# Altium schematic sheet [2] MicroController.SchDoc
size A4; Organization: UNMEI ELECTRICAL; Address1: 16B/12 Nguyen Du Street; Address2: Da Lat City, LD Province; SheetNumber: 2; SheetTotal: 7
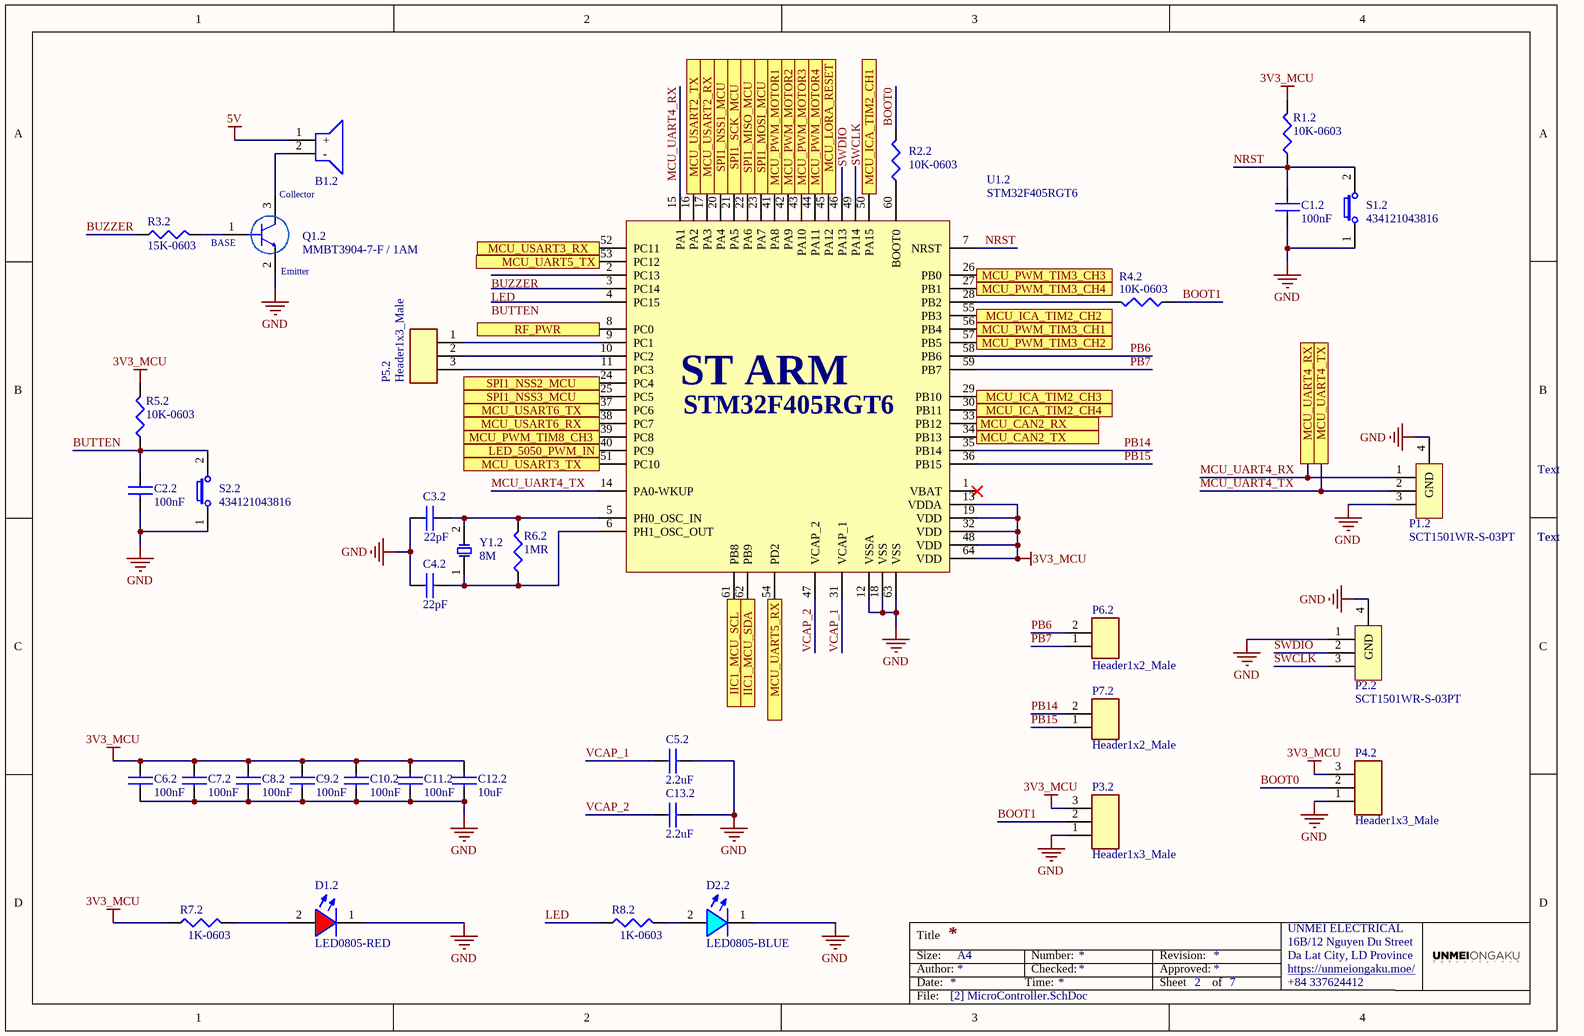
[diagram p0: [2] MicroController.SchDoc]

## Parts
B1.2  Buzzer  [Buzzer 9x5mm 60dB]  (value not drawn)
C1.2  100nF  [CAP0603]
C2.2  100nF  [CAP0603]
C3.2  22pF  [CAP0603]
C4.2  22pF  [CAP0603]
C5.2  2.2uF  [CAP0603]
C6.2  100nF  [CAP0603]
C7.2  100nF  [CAP0603]
C8.2  100nF  [CAP0603]
C9.2  100nF  [CAP0603]
C10.2  100nF  [CAP0603]
C11.2  100nF  [CAP0603]
C12.2  10uF  [CAP0603]
C13.2  2.2uF  [CAP0603]
D1.2  LED0805-RED  [LED0805-RED]
D2.2  LED0805-BLUE  [LED0805-BLUE]
P1.2  SCT1501WR-S-03PT  [Connector ZH1.5 3P SMD]
P2.2  SCT1501WR-S-03PT  [Connector ZH1.5 3P SMD]
P3.2  Header1x3_Male  [HDR1x3_2.54_MALE]
P4.2  Header1x3_Male  [HDR1x3_2.54_MALE]
P5.2  Header1x3_Male  [HDR1x3_2.54_MALE]
P6.2  Header1x2_Male  [HDR1x2_2.54_MALE]
P7.2  Header1x2_Male  [HDR1x2_2.54_MALE]
Q1.2  MMBT3904-7-F / 1AM  [SOT23]
R1.2  10K-0603  [RES0603 - 3D]
R2.2  10K-0603  [RES0603 - 3D]
R3.2  15K-0603  [RES0603 - 3D]
R4.2  10K-0603  [RES0603 - 3D]
R5.2  10K-0603  [RES0603 - 3D]
R6.2  1MR  [RES0603 - 3D]
R7.2  1K-0603  [RES0603 - 3D]
R8.2  1K-0603  [RES0603 - 3D]
S1.2  434121043816  [Switches-6x3.5x4.3mm]
S2.2  434121043816  [Switches-6x3.5x4.3mm]
U1.2  STM32F405RGT6  [LQFP64]
Y1.2  8M  [HC49-S]

## Ports
IIC1_MCU_SCL, IIC1_MCU_SDA, LED_5050_PWM_IN, MCU_CAN2_RX, MCU_CAN2_TX, MCU_ICA_TIM2_CH1, MCU_ICA_TIM2_CH2, MCU_ICA_TIM2_CH3, MCU_ICA_TIM2_CH4, MCU_LORA_RESET, MCU_PWM_MOTOR1, MCU_PWM_MOTOR2, MCU_PWM_MOTOR3, MCU_PWM_MOTOR4, MCU_PWM_TIM3_CH1, MCU_PWM_TIM3_CH2, MCU_PWM_TIM3_CH3, MCU_PWM_TIM3_CH4, MCU_PWM_TIM8_CH3, MCU_UART4_RX, MCU_UART4_TX, MCU_UART5_RX, MCU_UART5_TX, MCU_USART2_RX, MCU_USART2_TX, MCU_USART3_RX, MCU_USART3_TX, MCU_USART6_RX, MCU_USART6_TX, RF_PWR, SPI1_MISO_MCU, SPI1_MOSI_MCU, SPI1_NSS1_MCU, SPI1_NSS2_MCU, SPI1_NSS3_MCU, SPI1_SCK_MCU

## Nets
3V3_MCU: C6.2.1 C7.2.1 C8.2.1 C9.2.1 C10.2.1 C11.2.1 C12.2.1 P3.2.3 P4.2.3 R1.2.2 R5.2.2 R7.2.1 U1.2.13(VDDA) U1.2.19(VDD) U1.2.32(VDD) U1.2.48(VDD) U1.2.64(VDD)
5V: B1.2.1(+)
GND: C1.2.2 C2.2.2 C3.2.1 C4.2.1 C5.2.2 C6.2.2 C7.2.2 C8.2.2 C9.2.2 C10.2.2 C11.2.2 C12.2.2 C13.2.2 D1.2.1(+) D2.2.1(+) P1.2.3 P1.2.4(GND) P2.2.1 P2.2.4(GND) P3.2.1 P4.2.1 Q1.2.2 S1.2.1 S2.2.1 U1.2.12(VSSA) U1.2.18(VSS) U1.2.63(VSS)
BOOT0: P4.2.2 R2.2.2
BOOT1: P3.2.2 R4.2.1
BUTTEN: C2.2.1 R5.2.1 S2.2.2 U1.2.4(PC15)
BUZZER: R3.2.1 U1.2.2(PC13)
IIC1_MCU_SCL: U1.2.61(PB8) ; port IIC1_MCU_SCL
IIC1_MCU_SDA: U1.2.62(PB9) ; port IIC1_MCU_SDA
LED: R8.2.1 U1.2.3(PC14)
LED_5050_PWM_IN: U1.2.40(PC9) ; port LED_5050_PWM_IN
MCU_CAN2_RX: U1.2.33(PB12) ; port MCU_CAN2_RX
MCU_CAN2_TX: U1.2.34(PB13) ; port MCU_CAN2_TX
MCU_ICA_TIM2_CH1: U1.2.50(PA15) ; port MCU_ICA_TIM2_CH1
MCU_ICA_TIM2_CH2: U1.2.55(PB3) ; port MCU_ICA_TIM2_CH2
MCU_ICA_TIM2_CH3: U1.2.29(PB10) ; port MCU_ICA_TIM2_CH3
MCU_ICA_TIM2_CH4: U1.2.30(PB11) ; port MCU_ICA_TIM2_CH4
MCU_LORA_RESET: U1.2.45(PA12) ; port MCU_LORA_RESET
MCU_PWM_MOTOR1: U1.2.41(PA8) ; port MCU_PWM_MOTOR1
MCU_PWM_MOTOR2: U1.2.42(PA9) ; port MCU_PWM_MOTOR2
MCU_PWM_MOTOR3: U1.2.43(PA10) ; port MCU_PWM_MOTOR3
MCU_PWM_MOTOR4: U1.2.44(PA11) ; port MCU_PWM_MOTOR4
MCU_PWM_TIM3_CH1: U1.2.56(PB4) ; port MCU_PWM_TIM3_CH1
MCU_PWM_TIM3_CH2: U1.2.57(PB5) ; port MCU_PWM_TIM3_CH2
MCU_PWM_TIM3_CH3: U1.2.26(PB0) ; port MCU_PWM_TIM3_CH3
MCU_PWM_TIM3_CH4: U1.2.27(PB1) ; port MCU_PWM_TIM3_CH4
MCU_PWM_TIM8_CH3: U1.2.39(PC8) ; port MCU_PWM_TIM8_CH3
MCU_UART4_RX: P1.2.1 U1.2.15(PA1) ; port MCU_UART4_RX
MCU_UART4_TX: P1.2.2 U1.2.14(PA0-WKUP) ; port MCU_UART4_TX
MCU_UART5_RX: U1.2.54(PD2) ; port MCU_UART5_RX
MCU_UART5_TX: U1.2.53(PC12) ; port MCU_UART5_TX
MCU_USART2_RX: U1.2.17(PA3) ; port MCU_USART2_RX
MCU_USART2_TX: U1.2.16(PA2) ; port MCU_USART2_TX
MCU_USART3_RX: U1.2.52(PC11) ; port MCU_USART3_RX
MCU_USART3_TX: U1.2.51(PC10) ; port MCU_USART3_TX
MCU_USART6_RX: U1.2.38(PC7) ; port MCU_USART6_RX
MCU_USART6_TX: U1.2.37(PC6) ; port MCU_USART6_TX
NRST: C1.2.1 R1.2.1 S1.2.2 U1.2.7(NRST)
PB6: P6.2.2 U1.2.58(PB6)
PB7: P6.2.1 U1.2.59(PB7)
PB14: P7.2.2 U1.2.35(PB14)
PB15: P7.2.1 U1.2.36(PB15)
RF_PWR: U1.2.8(PC0) ; port RF_PWR
SPI1_MISO_MCU: U1.2.22(PA6) ; port SPI1_MISO_MCU
SPI1_MOSI_MCU: U1.2.23(PA7) ; port SPI1_MOSI_MCU
SPI1_NSS1_MCU: U1.2.20(PA4) ; port SPI1_NSS1_MCU
SPI1_NSS2_MCU: U1.2.24(PC4) ; port SPI1_NSS2_MCU
SPI1_NSS3_MCU: U1.2.25(PC5) ; port SPI1_NSS3_MCU
SPI1_SCK_MCU: U1.2.21(PA5) ; port SPI1_SCK_MCU
SWCLK: P2.2.3 U1.2.49(PA14)
SWDIO: P2.2.2 U1.2.46(PA13)
VCAP_1: C5.2.1 U1.2.31(VCAP_1)
VCAP_2: C13.2.1 U1.2.47(VCAP_2)
NetB1.2_2: B1.2.2(-) Q1.2.3
NetC3.2_2: C3.2.2 R6.2.2 U1.2.5(PH0_OSC_IN) Y1.2.2
NetC4.2_2: C4.2.2 R6.2.1 U1.2.6(PH1_OSC_OUT) Y1.2.1
NetD1.2_2: D1.2.2(+) R7.2.2
NetD2.2_2: D2.2.2(+) R8.2.2
NetP5.2_1: P5.2.1 U1.2.9(PC1)
NetP5.2_2: P5.2.2 U1.2.10(PC2)
NetP5.2_3: P5.2.3 U1.2.11(PC3)
NetQ1.2_1: Q1.2.1 R3.2.2
NetR2.2_1: R2.2.1 U1.2.60(BOOT0)
NetR4.2_2: R4.2.2 U1.2.28(PB2)

Not connected (* = marked no-connect by the designer): U1.2 1(VBAT)*

## Notes on the sheet
- Text
- Title
- Size:
- Date:
- Author:
- A4
- Time:
- Number:
- Checked:
- Revision:
- Sheet
- Approved:
- of
- https://unmeiongaku.moe/
- +84 337624412
- File:
- (in symbol MMBT3904-7-F / 1AM) Collector; BASE; Emitter
- (in symbol STM32F405RGT6) ST ARM

## Library data of the parts
B1.2 = Buzzer 9050 - DIP: 9050 DIP Buzzer 9x5mm 60dB; Local Supplier: thegioiic; Local Supplier Link: https://www.thegioiic.com/products/1209-dip-buzzer-12x9mm; Local Supplier Part Number: 1209 DIP Buzzer 12x9mm
C1.2 C2.2 C6.2 C7.2 C8.2 C9.2 C10.2 C11.2 = CC0603KRX7R9BB104: CAP CER 0.1UF 50V X7R 0603; Manufacturer 1: Yageo; Category 1: Capacitors; Capacitance: 0.1µF; Tolerance: ±10%; Supplier 1: Digi-Key; Supplier Part Number 1: 311-1344-1-ND; Manufacturer Part Number 1: CC0603KRX7R9BB104; RoHS 1: RoHS Compliant; Description 1: CAP CER 0.1UF 50V X7R 0603; Stock 1: 4411645; Pricing 1: 1=0.1, 10=0.031, 100=0.014, 500=0.00998, 1000=0.00783 (USD); Packaging: Cut Tape (CT); Part Status: Active; Voltage - Rated: 50V; Temperature Coefficient: X7R; Operating Temperature: -55°C ~ 125°C; Features: -; Ratings: -; Applications: General Purpose; Failure Rate: -; Mounting Type: Surface Mount, MLCC; Package / Case: 0603 (1608 Metric); Size / Dimension: 0.063" L x 0.031" W (1.60mm x 0.80mm); Height - Seated (Max): -; Thickness (Max): 0.035" (0.90mm); Lead Spacing: -; Lead Style: -; ComponentLink1URL: http://www.yageo.com/documents/recent/UPY-GPHC_X7R_6.3V-to-50V_18.pdf; ComponentLink1Description: http://www.yageo.com/documents/recent/UPY-GPHC_X7R_6.3V-to-50V_18.pdf; Value: 100nF
C3.2 C4.2 = CC0603JRNPO9BN220: Surface Mount Ceramic Multilayer Capacitor 22pF 5% C0G 50V 0603 Paper T/R; Manufacturer: Yageo; Insulation Resistance: 10GR; Temperature Coefficient: 30ppm/°C; Supplier 1: Newark; Manufacturer Part Number: CC0603JRNPO9BN220; RoHS: Yes; Category: Ceramic Capacitors; Stock 1: 70605; Pricing 1: 1=0.10000, 10=0.02100, 25=0.02000, 50=0.01900, 100=0.01800 (USD); Mount: Surface Mount; Case/Package: 0603; Number of Pins: 2; Case Code (Imperial): 0603; Case Code (Metric): 1608; Min Operating Temperature: -55°C; Max Operating Temperature: 125°C; Capacitance: 22pF; Tolerance: 5%; Voltage Rating: 50V; Packaging: Tape and Reel; Dielectric: C0G; Termination: SMD/SMT; Series: CC; Voltage Rating (DC): 50V; Package Quantity: 1; Voltage: 50V; Length: 1.6mm; Width: 0.031inch; Height: 0.8mm; Thickness: 0.035inch; Depth: 0.8mm; Radiation Hardening: No; Lead Free: Lead Free; RoHS Compliant: Yes; Reach SVHC Compliant: Yes; Supplier Part Number 1: 46WX087
C5.2 C13.2 = CC0603KRX7R6BB225: CAP CER 2.2UF 10V X7R 0603; Manufacturer 1: Yageo; Category 1: Capacitors; Capacitance: 2.2µF; Tolerance: ±10%; Supplier 1: Digi-Key; Supplier Part Number 1: 311-1797-1-ND; Manufacturer Part Number 1: CC0603KRX7R6BB225; RoHS 1: RoHS Compliant; Description 1: CAP CER 2.2UF 10V X7R 0603; Stock 1: 14291; Pricing 1: 1=0.32, 10=0.219, 100=0.1238, 500=0.0874, 1000=0.07648 (USD); Packaging: Cut Tape (CT); Part Status: Active; Voltage - Rated: 10V; Temperature Coefficient: X7R; Operating Temperature: -55°C ~ 125°C; Features: -; Ratings: -; Applications: General Purpose; Failure Rate: -; Mounting Type: Surface Mount, MLCC; Package / Case: 0603 (1608 Metric); Size / Dimension: 0.063" L x 0.031" W (1.60mm x 0.80mm); Height - Seated (Max): -; Thickness (Max): 0.035" (0.90mm); Lead Spacing: -; Lead Style: -; ComponentLink1URL: http://www.yageo.com/documents/recent/UPY-GPHC_X7R_6.3V-to-50V_18.pdf; ComponentLink1Description: http://www.yageo.com/documents/recent/UPY-GPHC_X7R_6.3V-to-50V_18.pdf; Value: 2.2uF
C12.2 = CC0603KRX5R6BB106: CAP CER 10UF 10V X5R 0603; Manufacturer 1: Yageo; Category 1: Capacitors; Capacitance: 10µF; Tolerance: ±10%; Supplier 1: Digi-Key; Supplier Part Number 1: 311-1782-1-ND; Manufacturer Part Number 1: CC0603KRX5R6BB106; RoHS 1: RoHS Compliant; Description 1: CAP CER 10UF 10V X5R 0603; Stock 1: 66566; Pricing 1: 1=0.33, 10=0.225, 100=0.1272, 500=0.08982, 1000=0.07858 (USD); Packaging: Cut Tape (CT); Part Status: Active; Voltage - Rated: 10V; Temperature Coefficient: X5R; Operating Temperature: -55°C ~ 85°C; Features: -; Ratings: -; Applications: General Purpose; Failure Rate: -; Mounting Type: Surface Mount, MLCC; Package / Case: 0603 (1608 Metric); Size / Dimension: 0.063" L x 0.031" W (1.60mm x 0.80mm); Height - Seated (Max): -; Thickness (Max): 0.035" (0.90mm); Lead Spacing: -; Lead Style: -; ComponentLink1URL: http://www.yageo.com/documents/recent/UPY-GPHC_X5R_4V-to-50V_24.pdf; ComponentLink1Description: http://www.yageo.com/documents/recent/UPY-GPHC_X5R_4V-to-50V_24.pdf; Value: 10uF
P3.2 P4.2 P5.2 = HDR1x3_2.54_MALE: Header1x3_2.54_MALE
P6.2 P7.2 = HDR1x2_2.54_MALE: Header1x2_2.54_MALE
Q1.2 = MMBT3904-7-F / 1AM: Transistor General Purpose BJT NPN 40 Volt 0.2A Automotive 3-Pin SOT-23; Manufacturer: Diodes Zetex; Collector Emitter Breakdown Voltage: 40V; Max Power Dissipation: 300mW; Max Collector Current: 200mA; Transition Frequency: 300MHz; Collector Base Voltage (VCBO): 60V; Emitter Base Voltage (VEBO): 6V; Collector Emitter Saturation Voltage: 300mV; Element Configuration: Single; hFE Min: 100; Power Dissipation: 350mW; Number of Elements: 1; Supplier 1: Digi-Key; Manufacturer Part Number: MMBT3904-7-F; RoHS: Yes; Category: BJTs; Stock 1: 468030; Pricing 1: 3000=0.02271, 6000=0.02048, 15000=0.01781, 30000=0.01603, 75000=0.01425 (USD); Mount: Surface Mount; Case/Package: SOT-23; Number of Pins: 3; Contact Plating: Tin,Matte; Weight: 0.000282oz; Min Operating Temperature: -55°C; Max Operating Temperature: 150°C; Packaging: Tape and Reel; Polarity: NPN; Package Quantity: 3000; Collector Emitter Voltage (VCEO): 40V; Gain Bandwidth Product: 300MHz; Frequency: 300MHz; Max Breakdown Voltage: 40V; Series: -; Collector-emitter Voltage-Max: 300mV; Voltage Rating (DC): 40V; Max Frequency: 300MHz; Continuous Collector Current: 200mA; Length: 3.05mm; Width: 1.4mm; Height: 1mm; Radiation Hardening: No; RoHS Compliant: Yes; Lead Free: Lead Free; REACH SVHC: No SVHC; ComponentLink1URL: https://datasheet.ciiva.com/11201/ds30036-11201778.pdf?src-supplier=Avnet; ComponentLink1Description: https://datasheet.ciiva.com/11201/ds30036-11201778.pdf?src-supplier=Avnet; ComponentLink2URL: https://datasheet.ciiva.com/15138/getdatasheetpartid-53265-15138780.pdf?src-supplier=Verical; ComponentLink2Description: https://datasheet.ciiva.com/15138/getdatasheetpartid-53265-15138780.pdf?src-supplier=Verical; ComponentLink3URL: https://datasheet.ciiva.com/22711/1915516-22711750.pdf?src-supplier=Element14; ComponentLink3Description: https://datasheet.ciiva.com/22711/1915516-22711750.pdf?src-supplier=Element14; ComponentLink4URL: https://datasheet.ciiva.com/11198/ds30036-11198999.pdf?src-supplier=Avnet; ComponentLink4Description: https://datasheet.ciiva.com/11198/ds30036-11198999.pdf?src-supplier=Avnet; ComponentLink5URL: https://datasheet.ciiva.com/6361/ds30036-6361256.pdf?src-supplier=Digi-Key; ComponentLink5Description: https://datasheet.ciiva.com/6361/ds30036-6361256.pdf?src-supplier=Digi-Key; ComponentLink6URL: https://datasheet.ciiva.com/6361/ds30036-6361254.pdf?src-supplier=Digi-Key; ComponentLink6Description: https://datasheet.ciiva.com/6361/ds30036-6361254.pdf?src-supplier=Digi-Key; Supplier Part Number 1: MMBT3904-FDITR-ND
R1.2 R2.2 R4.2 R5.2 = RC0603FR-0710KL: RES SMD 10K OHM 1% 1/10W 0603; Manufacturer: Yageo; Power (Watts): 0.1W, 1/10W; Temperature Coefficient: ±100ppm/°C; Supplier 1: Digi-Key; Manufacturer Part Number: RC0603FR-0710KL; RoHS: RoHS Compliant; Category: Resistors; Stock 1: 16545228; Pricing 1: 1=0.1, 10=0.015, 100=0.006, 1000=0.00268, 2500=0.00233 (USD); Packaging: Cut Tape (CT); Part Status: Active; Composition: Thick Film; Features: Moisture Resistant; Operating Temperature: -55°C ~ 155°C; Package / Case: 0603 (1608 Metric); Supplier Device Package: 0603; Size / Dimension: 0.063" L x 0.032" W (1.60mm x 0.80mm); Height - Seated (Max): 0.022" (0.55mm); Failure Rate: -; ComponentLink1URL: http://www.yageo.com/documents/recent/PYu-RC_Group_51_RoHS_L_7.pdf; ComponentLink1Description: http://www.yageo.com/documents/recent/PYu-RC_Group_51_RoHS_L_7.pdf; Supplier Part Number 1: 311-10.0KHRCT-ND; Value: 10K; Tolerance: ±1%
R3.2 = RC0603JR-0715KL: Thick Film Resistors - SMD 15K OHM 5%; Manufacturer: Yageo; Power Rating: 100 mW, 200 mW; Resistance: 15 kOhms; Temperature Coefficient: 100 PPM / C; Voltage Rating: 75 V; Supplier 1: Mouser; Manufacturer Part Number: RC0603JR-0715KL; RoHS: RoHS Compliant; Category: Thick Film Resistors - SMD; Stock 1: 39889; Pricing 1: 1=0.100, 10=0.015, 100=0.005, 1000=0.004, 5000=0.004 (USD); Application: High Reliability; Features: -; Height: 0.45 mm; Length: 1.6 mm; Package / Case: 0603 (1608 metric); Packaging: Cut Tape; Product: Thick Film Resistors SMD; Series: RC; Technology: Thick Film; Termination Style: SMD/SMT; Tolerance: 5 %; Type: General Purpose; Width: 0.8 mm; Brand: Yageo; Mounting Style: PCB Mount; Case Code - in: 0603; Case Code - mm: 1608; Maximum Operating Temperature: + 155 C; Minimum Operating Temperature: - 55 C; Product Type: Thick Film Resistors; Standard Pack Qty: 5000; Subcategory: Resistors; RoHS - Mouser: Y; Minimum Order Quantity: 1; Reeling: True; ComponentLink1URL: http://www.mouser.com/datasheet/2/447/PYu-RC_Group_51_RoHS_L_9-1314892.pdf; ComponentLink1Description: http://www.mouser.com/datasheet/2/447/PYu-RC_Group_51_RoHS_L_9-1314892.pdf; Supplier Part Number 1: 603-RC0603JR-0715KL; Value: 15K
R6.2 = RC0603JR-071ML: RES SMD 1M OHM 5% 1/10W 0603; Manufacturer 1: Yageo; Category 1: Resistors; Power (Watts): 0.1W, 1/10W; Temperature Coefficient: ±100ppm/°C; Supplier 1: Digi-Key; Supplier Part Number 1: 311-1.0MGRCT-ND; Manufacturer Part Number 1: RC0603JR-071ML; RoHS 1: RoHS Compliant; Description 1: RES SMD 1M OHM 5% 1/10W 0603; Stock 1: 1727458; Pricing 1: 1=0.1, 10=0.011, 100=0.0044, 1000=0.00198, 2500=0.00172 (USD); Packaging: Cut Tape (CT); Part Status: Active; Resistance (Ohms): 1M; Tolerance: ±5%; Composition: Thick Film; Features: Moisture Resistant; Operating Temperature: -55°C ~ 155°C; Package / Case: 0603 (1608 Metric); Supplier Device Package: 0603; Size / Dimension: 0.063" L x 0.031" W (1.60mm x 0.80mm); Height - Seated (Max): 0.022" (0.55mm); Failure Rate: -; ComponentLink1URL: http://www.yageo.com/documents/recent/PYu-RC_Group_51_RoHS_L_7.pdf; ComponentLink1Description: http://www.yageo.com/documents/recent/PYu-RC_Group_51_RoHS_L_7.pdf; Value: 1M
R7.2 R8.2 = RC0603JR-071KL: RES SMD 1K OHM 5% 1/10W 0603; Manufacturer 1: Yageo; Category 1: Resistors; Power (Watts): 0.1W, 1/10W; Temperature Coefficient: ±100ppm/°C; Supplier 1: Digi-Key; Supplier Part Number 1: 311-1.0KGRCT-ND; Manufacturer Part Number 1: RC0603JR-071KL; RoHS 1: RoHS Compliant; Description 1: RES SMD 1K OHM 5% 1/10W 0603; Stock 1: 2853955; Pricing 1: 1=0.1, 10=0.011, 100=0.0044, 1000=0.00198, 2500=0.00172 (USD); Packaging: Cut Tape (CT); Part Status: Active; Resistance (Ohms): 1k; Tolerance: ±5%; Composition: Thick Film; Features: Moisture Resistant; Operating Temperature: -55°C ~ 155°C; Package / Case: 0603 (1608 Metric); Supplier Device Package: 0603; Size / Dimension: 0.063" L x 0.031" W (1.60mm x 0.80mm); Height - Seated (Max): 0.022" (0.55mm); Failure Rate: -; ComponentLink1URL: http://www.yageo.com/documents/recent/PYu-RC_Group_51_RoHS_L_7.pdf; ComponentLink1Description: http://www.yageo.com/documents/recent/PYu-RC_Group_51_RoHS_L_7.pdf; Value: 1K
S1.2 S2.2 = 434121043816: Switch Tactile Spst-no 0.05A 12V; Manufacturer: Wurth Electronics; Mechanical Life: 50000Cycles; Actuator Material: Polymer,Liquid Crystal Polymer; Contact Current Rating: 50mA; Operating Force: 160gf; Illumination Type: Non-Illuminated,Illuminated; Throw Configuration: SPST; Insulation Resistance: 100MR; Switch Travel: 0.25mm; Switch Function: Off-Mom; Actuator Length: 0.8mm; Supplier 1: RSComponents; Manufacturer Part Number: 434121043816; RoHS: Yes; Category: Tactile Switches; Stock 1: 337; Pricing 1: 1=1.69500 (USD); Mount: Surface Mount; Contact Material: Stainless Steel,Steel; Min Operating Temperature: -40°C; Max Operating Temperature: 85°C; Current Rating: 50mA; Packaging: Tape and Reel; Termination: SMD/SMT; Series: WS-TASV; Contact Type: 1 maker; Length: 8mm; Width: 3.5mm; Height: 4.3mm; REACH SVHC: No SVHC; RoHS Compliant: Yes; ComponentLink1URL: https://datasheet.ciiva.com/30466/0900766b8126b631-30466746.pdf?src-supplier=RSComponents; ComponentLink1Description: https://datasheet.ciiva.com/30466/0900766b8126b631-30466746.pdf?src-supplier=RSComponents; ComponentLink2URL: https://datasheet.ciiva.com/29123/711754-da-01-en-taster-434121043816-29123819.pdf?src-supplier=Conrad; ComponentLink2Description: https://datasheet.ciiva.com/29123/711754-da-01-en-taster-434121043816-29123819.pdf?src-supplier=Conrad; ComponentLink3URL: https://datasheet.ciiva.com/1532/434121043816-1532524.pdf?src-supplier=Element14; ComponentLink3Description: https://datasheet.ciiva.com/1532/434121043816-1532524.pdf?src-supplier=Element14; ComponentLink4URL: https://datasheet.ciiva.com/1633/434121043816-1633934.pdf?src-supplier=Farnell; ComponentLink4Description: https://datasheet.ciiva.com/1633/434121043816-1633934.pdf?src-supplier=Farnell; Supplier Part Number 1: 7856421
U1.2 = STM32F405RGT6: IC MCU 32BIT 1MB FLASH 64LQFP; Manufacturer: STMicroelectronics; Core Architecture: ARM; Interface: I2C,SPI,USB,CAN,IrDA,UART,USART,LIN,I2S; Data Bus Width: 32b; Frequency: 168MHz; RAM Size: 196KB; Number of I/Os: 51; Max Supply Voltage: 3.6V; Min Supply Voltage: 1.8V; Memory Size: 1024KB; Number of Timers/Counters: 14; Number of ADC Channels: 16; Oscillator Type: Internal; Number of SPI Channels: 3; Peripherals: Brown-out Detect/Reset,POR,PWM,WDT,DMA,LCD,I2C; Number of PWM Channels: 2; Watchdog Timer: Yes; Supplier 1: Newark; Manufacturer Part Number: STM32F405RGT6; RoHS: Yes; Category: Microcontrollers; Pricing 1: 1=16.96000, 10=15.60000, 25=14.94000, 50=14.35000, 100=13.76000, 250=13.17000, 500=11.78000 (USD); Case/Package: LQFP; Number of Pins: 64; Min Operating Temperature: -40°C; Max Operating Temperature: 85°C; Package Quantity: 960; Packaging: Tray; Max Frequency: 168MHz; Number of I2C Channels: 3; Memory Type: FLASH; Number of UART Channels: 2; Series: STM32 F4; Number of Programmable I/O: 51; Length: 10mm; Width: 10mm; Height: 1.45mm; Radiation Hardening: No; Reach SVHC Compliant: Yes; RoHS Compliant: Yes; Lead Free: Lead Free; ComponentLink1URL: https://datasheet.ciiva.com/8055/1717982-8055024.pdf?src-supplier=Element14; ComponentLink1Description: https://datasheet.ciiva.com/8055/1717982-8055024.pdf?src-supplier=Element14; ComponentLink2URL: https://datasheet.ciiva.com/4837/dm00037051-492832-4837997.pdf?src-supplier=Mouser; ComponentLink2Description: https://datasheet.ciiva.com/4837/dm00037051-492832-4837997.pdf?src-supplier=Mouser; Supplier Part Number 1: 71T9854
Y1.2 = Crystals - HC49SSDLF-8.00MHz: Crystals LO-PRO 8MHz; Manufacturer: Fox Electronics; Supplier 1: Mouser; Manufacturer Part Number: HC49SSDLF-8.00MHz; RoHS: Yes; Category: Uncategorized; Frequency: 8MHz; Packaging: Tape and Reel; Package Quantity: 1000; Termination: SMD/SMT; Length: 13.2mm; Width: 5mm; Height: 3.2mm; ComponentLink1URL: https://datasheet.ciiva.com/12388/hc49ssdlf-16337-12388064.pdf?src-supplier=Mouser; ComponentLink1Description: https://datasheet.ciiva.com/12388/hc49ssdlf-16337-12388064.pdf?src-supplier=Mouser; Supplier Part Number 1: 559-280LF-080